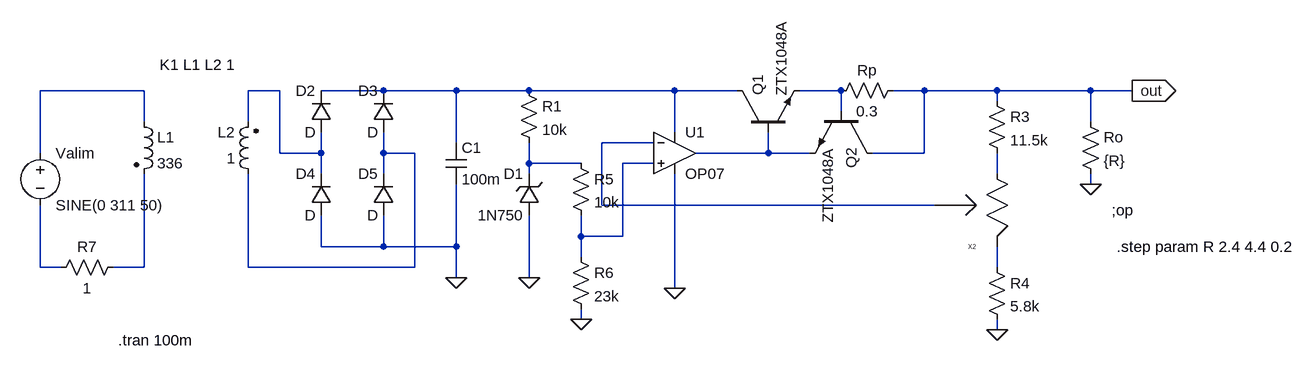
[diagram p0: schematic BobosAnamariaCADEschema.asc]
BobosAnamariaCADEschema.asc, the LTspice schematic file:
Version 4
SHEET 1 1392 680
WIRE -464 -32 -624 -32
WIRE -256 -32 -304 -32
WIRE -96 -32 -192 -32
WIRE 16 -32 -96 -32
WIRE 128 -32 16 -32
WIRE 352 -32 128 -32
WIRE 448 -32 352 -32
WIRE 608 -32 544 -32
WIRE 736 -32 688 -32
WIRE 848 -32 736 -32
WIRE 992 -32 848 -32
WIRE 1056 -32 992 -32
WIRE 848 -16 848 -32
WIRE 608 0 608 -32
WIRE -464 16 -464 -32
WIRE -304 16 -304 -32
WIRE 992 16 992 -32
WIRE 352 32 352 -32
WIRE 16 48 16 -32
WIRE 320 48 240 48
WIRE -624 64 -624 -32
WIRE -256 64 -256 -32
WIRE -192 64 -192 32
WIRE -192 64 -256 64
WIRE -96 64 -96 32
WIRE -48 64 -96 64
WIRE 496 64 496 32
WIRE 496 64 384 64
WIRE 560 64 496 64
WIRE 736 64 736 -32
WIRE 736 64 656 64
WIRE 128 80 128 48
WIRE 208 80 128 80
WIRE 320 80 272 80
WIRE -192 96 -192 64
WIRE -96 96 -96 64
WIRE 128 96 128 80
WIRE 848 96 848 64
WIRE 992 112 992 96
WIRE 240 144 240 48
WIRE 752 144 240 144
WIRE 208 192 208 160
WIRE 272 192 272 80
WIRE 272 192 208 192
WIRE -192 208 -192 160
WIRE -96 208 -96 160
WIRE -96 208 -192 208
WIRE 16 208 16 112
WIRE 16 208 -96 208
WIRE 208 224 208 192
WIRE -624 240 -624 144
WIRE -592 240 -624 240
WIRE -464 240 -464 96
WIRE -464 240 -512 240
WIRE -304 240 -304 96
WIRE -48 240 -48 64
WIRE -48 240 -304 240
WIRE 848 240 848 208
WIRE 16 256 16 208
WIRE 128 256 128 160
WIRE 352 272 352 96
WIRE 208 320 208 304
WIRE 848 336 848 320
FLAG 848 336 0
FLAG 352 272 0
FLAG 1056 -32 out
IOPIN 1056 -32 Out
FLAG 208 320 0
FLAG 128 256 0
FLAG 992 112 0
FLAG 16 256 0
SYMBOL OpAmps\\OP07 352 0 R0
SYMATTR InstName U1
SYMBOL zener 144 160 R180
WINDOW 0 24 64 Left 2
WINDOW 3 24 0 Left 2
SYMATTR InstName D1
SYMATTR Value 1N750
SYMBOL res 112 -48 R0
SYMATTR InstName R1
SYMATTR Value 10k
SYMBOL voltage -624 48 R0
WINDOW 123 0 0 Left 0
WINDOW 39 0 0 Left 0
SYMATTR InstName Valim
SYMATTR Value SINE(0 311 50)
SYMBOL npn 448 32 R270
SYMATTR InstName Q1
SYMATTR Value ZTX1048A
SYMBOL res 704 -48 R90
WINDOW 0 0 56 VBottom 2
WINDOW 3 32 56 VTop 2
SYMATTR InstName Rp
SYMATTR Value 0.3
SYMBOL res 832 -32 R0
SYMATTR InstName R3
SYMATTR Value 11.5k
SYMBOL res 832 224 R0
SYMATTR InstName R4
SYMATTR Value 5.8k
SYMBOL res 192 64 R0
SYMATTR InstName R5
SYMATTR Value 10k
SYMBOL res 192 208 R0
SYMATTR InstName R6
SYMATTR Value 23k
SYMBOL diode -176 32 R180
WINDOW 0 24 64 Left 2
WINDOW 3 24 0 Left 2
SYMATTR InstName D2
SYMBOL diode -80 32 R180
WINDOW 0 24 64 Left 2
WINDOW 3 24 0 Left 2
SYMATTR InstName D3
SYMBOL diode -176 160 R180
WINDOW 0 24 64 Left 2
WINDOW 3 24 0 Left 2
SYMATTR InstName D4
SYMBOL diode -80 160 R180
WINDOW 0 24 64 Left 2
WINDOW 3 24 0 Left 2
SYMATTR InstName D5
SYMBOL cap 0 48 R0
SYMATTR InstName C1
SYMATTR Value 100m
SYMBOL ind2 -480 0 R0
SYMATTR InstName L1
SYMATTR Value 336
SYMATTR Type ind
SYMBOL ind2 -288 112 R180
WINDOW 0 36 80 Left 2
WINDOW 3 36 40 Left 2
SYMATTR InstName L2
SYMATTR Value 1
SYMATTR Type ind
SYMBOL res -608 256 R270
WINDOW 0 32 56 VTop 2
WINDOW 3 0 56 VBottom 2
SYMATTR InstName R7
SYMATTR Value 1
SYMBOL res 976 0 R0
SYMATTR InstName Ro
SYMATTR Value {R}
SYMBOL npn 656 0 R90
SYMATTR InstName Q2
SYMATTR Value ZTX1048A
SYMBOL pot 864 192 R180
SYMATTR InstName X2
SYMATTR SpiceLine R=10k val=99
TEXT 1024 152 Left 2 !;op
TEXT -440 -72 Left 2 !K1 L1 L2 1
TEXT -504 352 Left 2 !.tran 100m
TEXT 1032 208 Left 2 !.step param R 2.4 4.4 0.2

The netlist it stands for:
* BobosAnamariaCADEschema.asc
XU1 N009 N005 N003 0 N007 LT1001  ; OP07, pins In+ In- V+ V- OUT
D1 0 N008 1N750
R1 N003 N008 10k
Valim N001 N011 SINE(0 311 50)
Q1 N003 N007 N004 0 ZTX1048A
Rp out N004 0.3
R3 out N010 11.5k
R4 N013 0 5.8k
R5 N008 N009 10k
R6 N009 0 23k
D2 N002 N003 D
D3 N006 N003 D
D4 0 N002 D
D5 0 N006 D
C1 N003 0 100m
L1 N001 N012 336
L2 N006 N002 1
R7 N011 N012 1
Ro out 0 {R}
Q2 out N004 N007 0 ZTX1048A
XX2 N013 N005 N010 pot R=10k val=99  ; pins 1 2 3
.model D D
.lib standard.dio
.model NPN NPN
.model PNP PNP
.lib standard.bjt
;op
K1 L1 L2 1
.tran 100m
.step param R 2.4 4.4 0.2
.lib LTC.lib
.backanno
.end